# Altium schematic sheet USB_Power.SchDoc
size A4
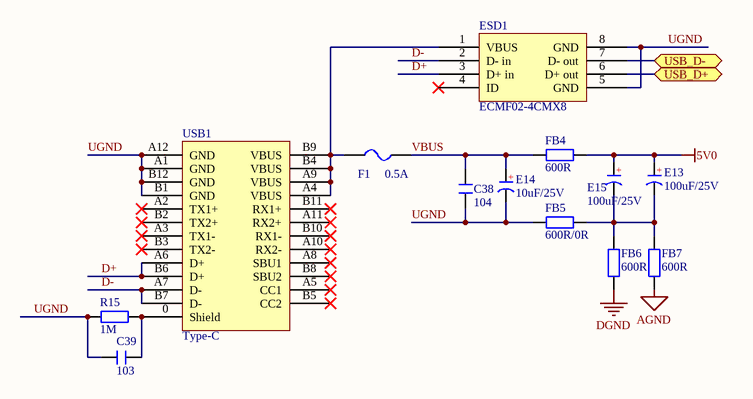
[diagram p0: USB_Power.SchDoc]

## Parts
C38  104  [C 0603_L]
C39  103  [C 0603_L]
E13  100uF/25V  [CD D(7343)]
E14  10uF/25V  [CD A(3216)]
E15  100uF/25V  [CD D(7343)]
ESD1  ECMF02-4CMX8  [QFN8L]
F1  0.5A  [FU 1206]
FB4  600R  [R 0805_L]
FB5  600R/0R  [R 0805_L]
FB6  600R  [R 0805_L]
FB7  600R  [R 0805_L]
R15  1M  [R 0603_L]
USB1  Type-C  [USB-TYPE-C_16PIN-MALE-TYPE-C-31-M-12]

## Ports
USB_D+, USB_D-

## Nets
5V0: E13.1(A) E15.1(A) FB4.2
AGND: FB7.1
DGND: FB6.1
D+: ESD1.3(D+_in) USB1.A6(D+) USB1.B6(D+)
D-: ESD1.2(D-_in) USB1.A7(D-) USB1.B7(D-)
UGND: C38.1 C39.2 E14.2(K) ESD1.5(GND) ESD1.8(GND) FB5.1 R15.2 USB1.A1(GND) USB1.A12(GND) USB1.B1(GND) USB1.B12(GND)
USB_D+: ESD1.6(D+_out) ; port USB_D+
USB_D-: ESD1.7(D-_out) ; port USB_D-
VBUS: C38.2 E14.1(A) F1.2 FB4.1
NetC39_1: C39.1 R15.1 USB1.0(Shield)
NetE13_2: E13.2(K) E15.2(K) FB5.2 FB6.2 FB7.2
NetESD1_1: ESD1.1(VBUS) F1.1 USB1.A4(VBUS) USB1.A9(VBUS) USB1.B4(VBUS) USB1.B9(VBUS)

Not connected (* = marked no-connect by the designer): ESD1 4(ID)*; USB1 A2(TX1+)* A3(TX1-)* A5(CC1)* A8(SBU1)* A10(RX2-)* A11(RX2+)* B2(TX2+)* B3(TX2-)* B5(CC2)* B8(SBU2)* B10(RX1-)* B11(RX1+)*

## Notes on the sheet
- (in symbol CT) +

## Library data of the parts
C38 C39 = C: 贴片电容; BOM名称: 无极性贴片电容; 优秀评价可免费更新: 联系淘宝ID：黄晶宝石，获取更新版封装库; 卖家免费技术支持，联系售后: 唯一出售店铺网址https://shop463601444.taobao.com; 本封装库来自淘宝卖家 ID：黄晶宝石: 其他店铺购入均为盗版，请立即申请退款
E13-E15 = CT: 贴片钽电容; 优秀评价可免费更新: 联系淘宝ID：黄晶宝石，获取更新版封装库; 卖家免费技术支持，联系售后: 唯一出售店铺网址https://shop463601444.taobao.com; 本封装库来自淘宝卖家 ID：黄晶宝石: 其他店铺购入均为盗版，请立即申请退款; BOM名称: 贴片钽电容
ESD1 = ECMF02-4CMX8: Common mode filter with ESD protection for USB 2.0 interface
F1 = FU: 贴片保险丝; 版权归属: 封装库来自淘宝卖家 ID：黄晶宝石; 优秀评价可免费更新: 联系淘宝ID：黄晶宝石，获取更新版封装库; 卖家免费技术支持，联系售后: 唯一出售店铺网址https://shop463601444.taobao.com; 封装库来自淘宝卖家 ID：黄晶宝石: 其他店铺购入均为盗版，请立即申请退款; BOM名称: 贴片保险丝
FB4-FB7 R15 = R: 贴片电阻; 优秀评价可免费更新: 联系淘宝ID：黄晶宝石，获取更新版封装库; 卖家免费技术支持，联系售后: 唯一出售店铺网址https://shop463601444.taobao.com; 本封装库来自淘宝卖家 ID：黄晶宝石: 其他店铺购入均为盗版，请立即申请退款; BOM名称: 贴片电阻